# EAGLE schematic wagband_schematic (EAGLE 7.5.0)

## Sheet 1 of 2
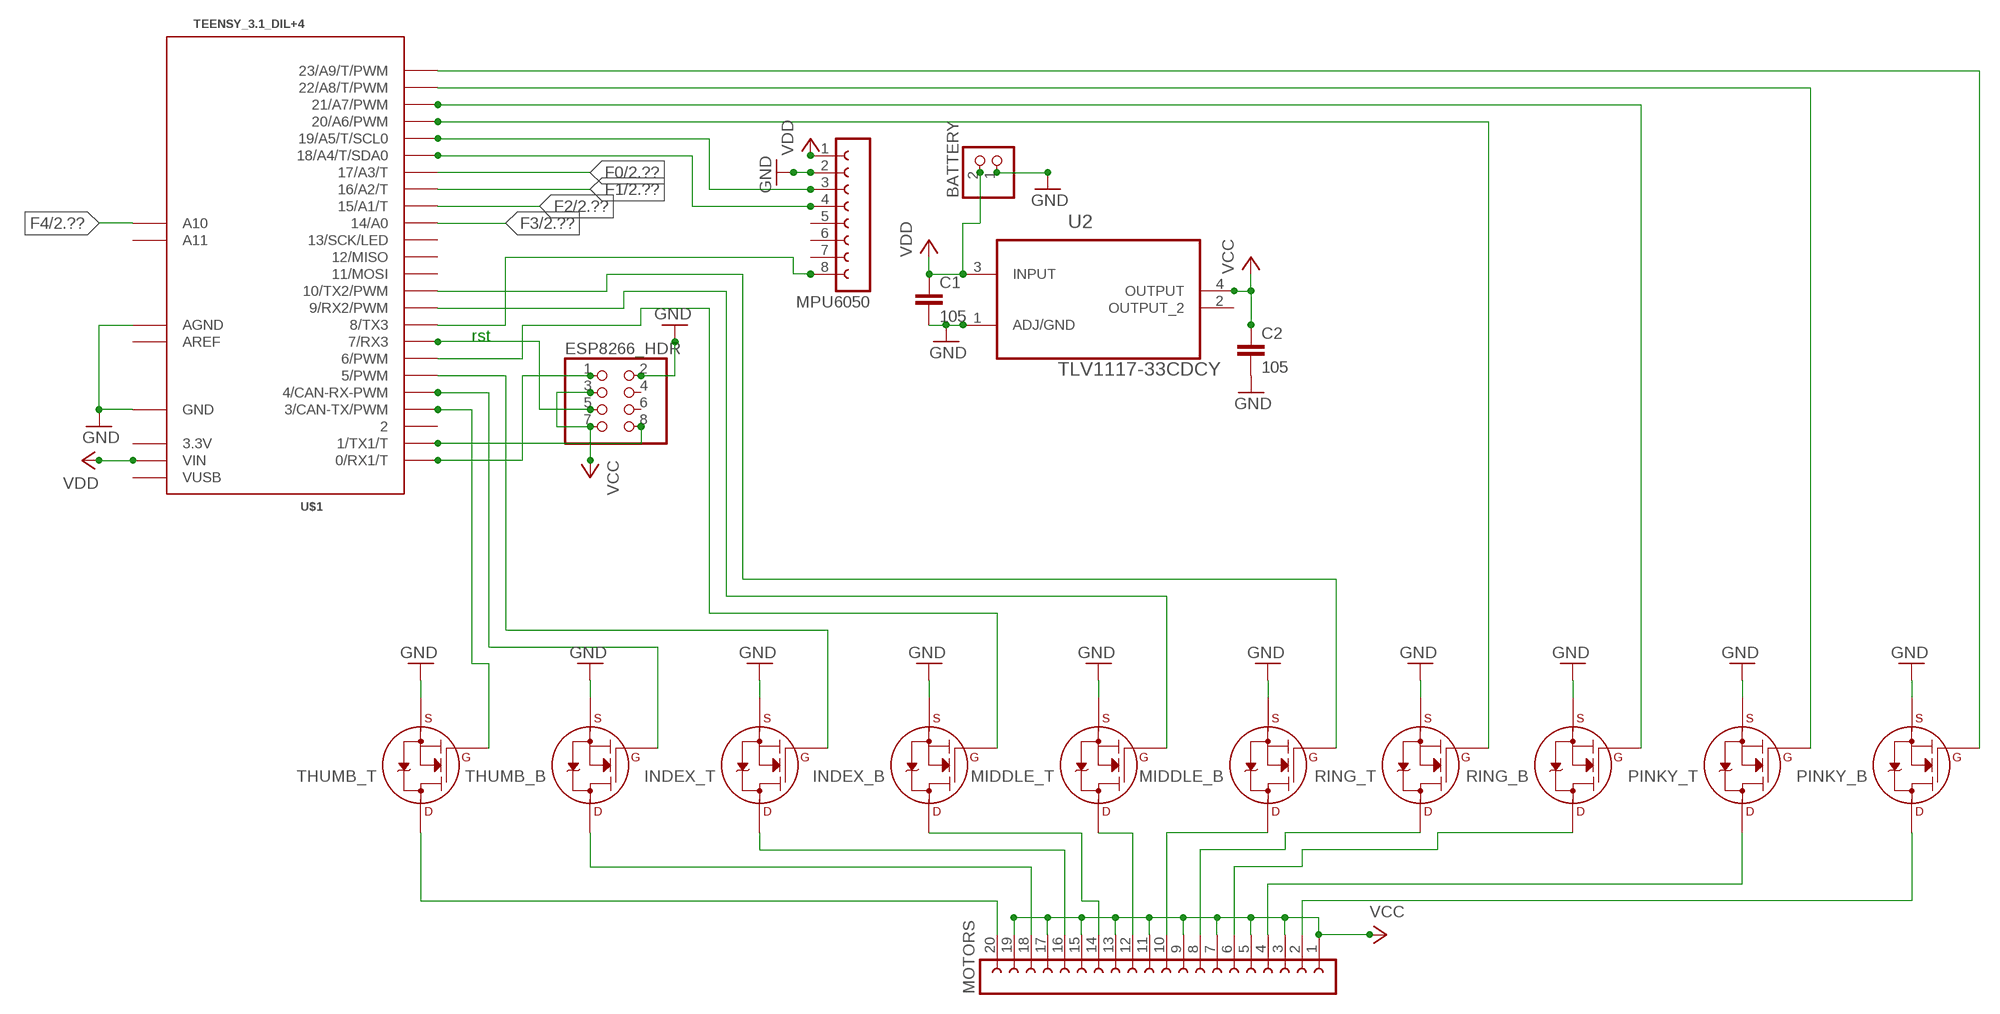
[diagram p0: schematic, sheet 1]

### Parts
BATTERY  JST_2PIN-THM-RA  [JST-PH-2-THM-RA]
C1  105  C-EU025-024X044  [C025-024X044]
C2  105  C-EU025-024X044  [C025-024X044]
ESP8266_HDR  PINHD-2X4  [2X04]
INDEX_B  2N7000_SOT23  [SOT-23]
INDEX_T  2N7000_SOT23  [SOT-23]
MIDDLE_B  2N7000_SOT23  [SOT-23]
MIDDLE_T  2N7000_SOT23  [SOT-23]
MOTORS  FE20W  [FE20W]
MPU6050  FE08-1  [FE08]
PINKY_B  2N7000_SOT23  [SOT-23]
PINKY_T  2N7000_SOT23  [SOT-23]
RING_B  2N7000_SOT23  [SOT-23]
RING_T  2N7000_SOT23  [SOT-23]
THUMB_B  2N7000_SOT23  [SOT-23]
THUMB_T  2N7000_SOT23  [SOT-23]
U2  TLV1117-33CDCY  [SOT230P700X180-4N]
U$1  TEENSY_3.1_DIL+4  [TEENSY3-DIL+4]

### Nets
F0: U$1.17/A3(17/A3/T) ; also sheet 2
F1: U$1.16/A2(16/A2/T) ; also sheet 2
F2: U$1.15/A1(15/A1/T) ; also sheet 2
F3: U$1.14/A0 ; also sheet 2
F4: U$1.A10 ; also sheet 2
GND: BATTERY.1 C1.2 C2.2 ESP8266_HDR.2 INDEX_B.2(S) INDEX_T.2(S) MIDDLE_B.2(S) MIDDLE_T.2(S) MPU6050.2 PINKY_B.2(S) PINKY_T.2(S) RING_B.2(S) RING_T.2(S) THUMB_B.2(S) THUMB_T.2(S) U2.1(ADJ/GND) U$1.AGND U$1.GND ; also sheet 2
N$1: RING_B.1(G) U$1.21/A7(21/A7/PWM)
N$2: INDEX_T.1(G) U$1.5(5/PWM)
N$3: RING_T.1(G) U$1.20/A6(20/A6/PWM)
N$4: MPU6050.4 U$1.18/A4(18/A4/T/SDA0)
N$5: THUMB_T.1(G) U$1.3(3/CAN-TX/PWM)
N$6: THUMB_B.1(G) U$1.4(4/CAN-RX-PWM)
N$7: ESP8266_HDR.1 U$1.0(0/RX1/T)
N$8: MPU6050.8 U$1.8(8/TX3)
N$9: MOTORS.20 THUMB_T.3(D)
N$10: MOTORS.18 THUMB_B.3(D)
N$11: INDEX_T.3(D) MOTORS.16
N$12: INDEX_B.3(D) MOTORS.14
N$13: MIDDLE_T.3(D) MOTORS.12
N$14: MIDDLE_B.3(D) MOTORS.10
N$15: MOTORS.8 RING_T.3(D)
N$16: INDEX_B.1(G) U$1.6(6/PWM)
N$17: MPU6050.3 U$1.19/A5(19/A5/T/SCL0)
N$18: MOTORS.6 RING_B.3(D)
N$19: ESP8266_HDR.8 U$1.1(1/TX1/T)
N$20: MOTORS.4 PINKY_T.3(D)
N$21: ESP8266_HDR.5 U$1.7(7/RX3)
N$22: MOTORS.2 PINKY_B.3(D)
N$23: MIDDLE_T.1(G) U$1.9(9/RX2/PWM)
N$25: MIDDLE_B.1(G) U$1.10(10/TX2/PWM)
N$26: PINKY_T.1(G) U$1.22/A8(22/A8/T/PWM)
N$27: PINKY_B.1(G) U$1.23/A9(23/A9/T/PWM)
VCC: BATTERY.2 C1.1 C2.1 ESP8266_HDR.3 ESP8266_HDR.7 MOTORS.1 MOTORS.3 MOTORS.5 MOTORS.7 MOTORS.9 MOTORS.11 MOTORS.13 MOTORS.15 MOTORS.17 MOTORS.19 MPU6050.1 U2.3(INPUT) U2.4(OUTPUT) U$1.VIN ; supply symbol labelled VDD
Unconnected: ESP8266_HDR.4 ESP8266_HDR.6 MPU6050.5 MPU6050.6 MPU6050.7 U2.2(OUTPUT_2) U$1.2 U$1.11(11/MOSI) U$1.12(12/MISO) U$1.13(13/SCK/LED) U$1.A11

### Notes on the sheet
- rst

## Sheet 2 of 2
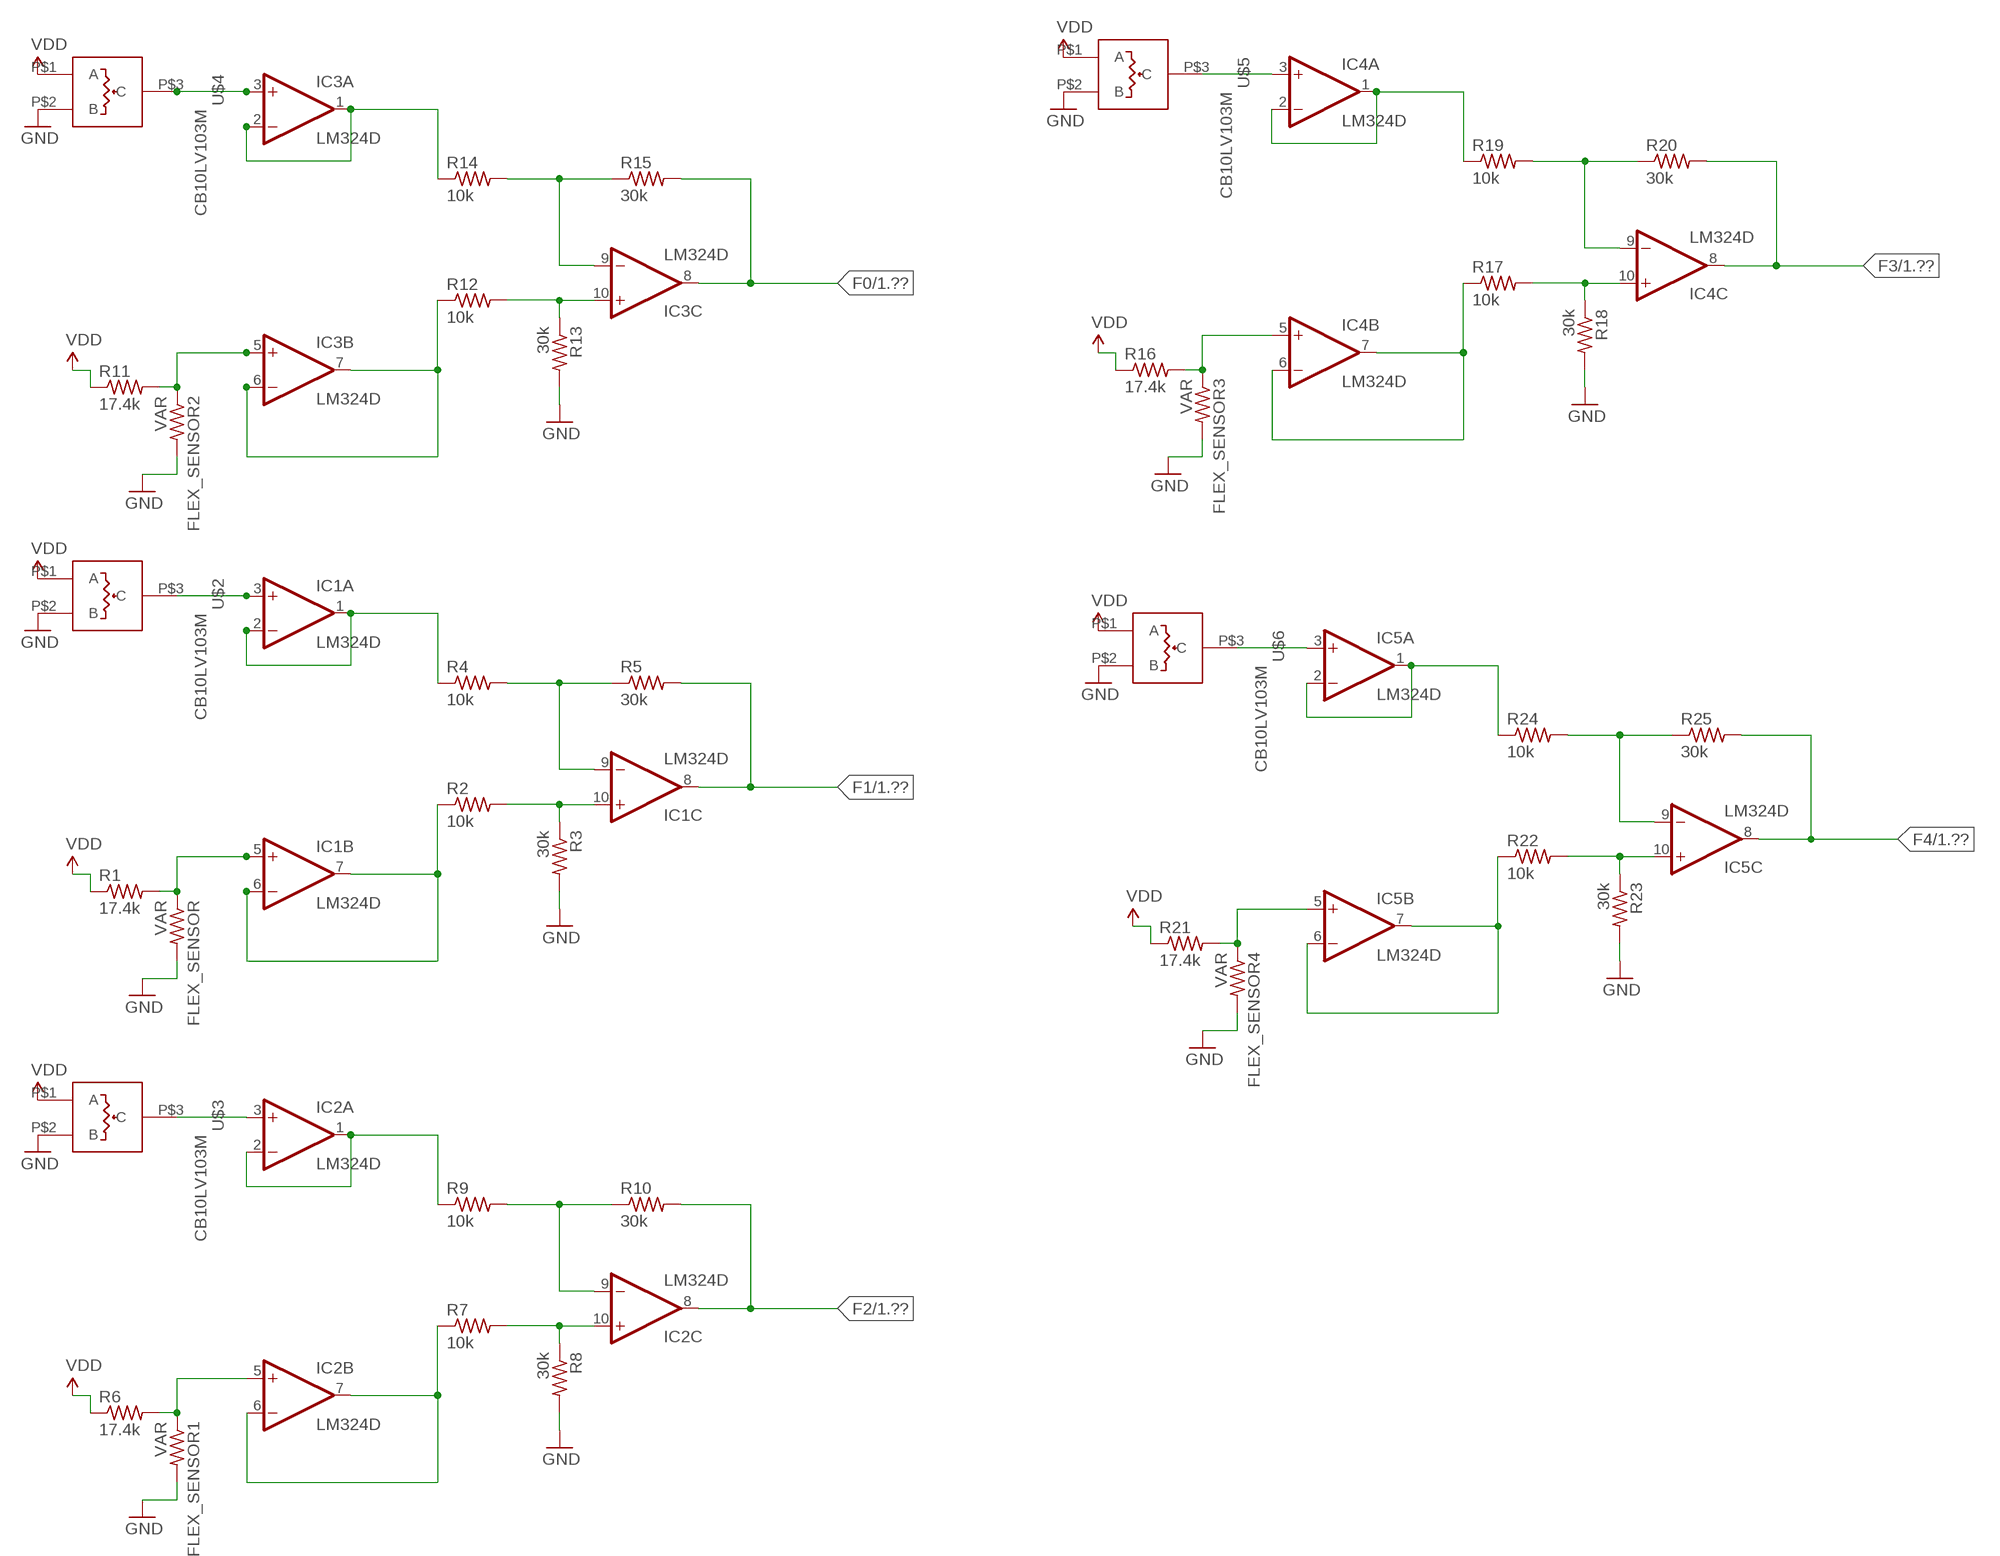
[diagram p1: schematic, sheet 2]

### Parts
FLEX_SENSOR  VAR  R-US_0207/2V  [0207/2V]
FLEX_SENSOR1  VAR  R-US_0207/2V  [0207/2V]
FLEX_SENSOR2  VAR  R-US_0207/2V  [0207/2V]
FLEX_SENSOR3  VAR  R-US_0207/2V  [0207/2V]
FLEX_SENSOR4  VAR  R-US_0207/2V  [0207/2V]
IC1  LM324D  [SO14]
IC2  LM324D  [SO14]
IC3  LM324D  [SO14]
IC4  LM324D  [SO14]
IC5  LM324D  [SO14]
R1  17.4k  R-US_R1206  [R1206]
R2  10k  R-US_R1206  [R1206]
R3  30k  R-US_R1206  [R1206]
R4  10k  R-US_R1206  [R1206]
R5  30k  R-US_R1206  [R1206]
R6  17.4k  R-US_R1206  [R1206]
R7  10k  R-US_R1206  [R1206]
R8  30k  R-US_R1206  [R1206]
R9  10k  R-US_R1206  [R1206]
R10  30k  R-US_R1206  [R1206]
R11  17.4k  R-US_R1206  [R1206]
R12  10k  R-US_R1206  [R1206]
R13  30k  R-US_R1206  [R1206]
R14  10k  R-US_R1206  [R1206]
R15  30k  R-US_R1206  [R1206]
R16  17.4k  R-US_R1206  [R1206]
R17  10k  R-US_R1206  [R1206]
R18  30k  R-US_R1206  [R1206]
R19  10k  R-US_R1206  [R1206]
R20  30k  R-US_R1206  [R1206]
R21  17.4k  R-US_R1206  [R1206]
R22  10k  R-US_R1206  [R1206]
R23  30k  R-US_R1206  [R1206]
R24  10k  R-US_R1206  [R1206]
R25  30k  R-US_R1206  [R1206]
U$2  CB10LV103M  [CB10]
U$3  CB10LV103M  [CB10]
U$4  CB10LV103M  [CB10]
U$5  CB10LV103M  [CB10]
U$6  CB10LV103M  [CB10]

### Nets
F0: IC3.8(C:OUT) R15.2 ; also sheet 1
F1: IC1.8(C:OUT) R5.2 ; also sheet 1
F2: IC2.8(C:OUT) R10.2 ; also sheet 1
F3: IC4.8(C:OUT) R20.2 ; also sheet 1
F4: IC5.8(C:OUT) R25.2 ; also sheet 1
GND: FLEX_SENSOR1.2 FLEX_SENSOR2.2 FLEX_SENSOR3.2 FLEX_SENSOR4.2 FLEX_SENSOR.2 R3.2 R8.2 R13.2 R18.2 R23.2 U$2.P$2(B) U$3.P$2(B) U$4.P$2(B) U$5.P$2(B) U$6.P$2(B) ; also sheet 1
N$24: FLEX_SENSOR.1 IC1.5(B:+IN) R1.2
N$28: IC1.3(A:+IN) U$2.P$3(C)
N$29: IC1.1(A:OUT) IC1.2(A:-IN) R4.1
N$30: IC1.6(B:-IN) IC1.7(B:OUT) R2.1
N$31: IC1.9(C:-IN) R4.2 R5.1
N$33: IC1.10(C:+IN) R2.2 R3.1
N$34: FLEX_SENSOR1.1 IC2.5(B:+IN) R6.2
N$35: IC2.1(A:OUT) IC2.2(A:-IN) R9.1
N$36: IC2.6(B:-IN) IC2.7(B:OUT) R7.1
N$37: IC2.9(C:-IN) R9.2 R10.1
N$38: IC2.10(C:+IN) R7.2 R8.1
N$39: IC2.3(A:+IN) U$3.P$3(C)
N$40: FLEX_SENSOR2.1 IC3.5(B:+IN) R11.2
N$41: IC3.1(A:OUT) IC3.2(A:-IN) R14.1
N$42: IC3.6(B:-IN) IC3.7(B:OUT) R12.1
N$43: IC3.9(C:-IN) R14.2 R15.1
N$44: IC3.10(C:+IN) R12.2 R13.1
N$45: IC3.3(A:+IN) U$4.P$3(C)
N$46: FLEX_SENSOR3.1 IC4.5(B:+IN) R16.2
N$47: IC4.1(A:OUT) IC4.2(A:-IN) R19.1
N$48: IC4.6(B:-IN) IC4.7(B:OUT) R17.1
N$49: IC4.9(C:-IN) R19.2 R20.1
N$50: IC4.10(C:+IN) R17.2 R18.1
N$51: IC4.3(A:+IN) U$5.P$3(C)
N$52: FLEX_SENSOR4.1 IC5.5(B:+IN) R21.2
N$53: IC5.1(A:OUT) IC5.2(A:-IN) R24.1
N$54: IC5.6(B:-IN) IC5.7(B:OUT) R22.1
N$55: IC5.9(C:-IN) R24.2 R25.1
N$56: IC5.10(C:+IN) R22.2 R23.1
N$57: IC5.3(A:+IN) U$6.P$3(C)
VDD: R1.1 R6.1 R11.1 R16.1 R21.1 U$2.P$1(A) U$3.P$1(A) U$4.P$1(A) U$5.P$1(A) U$6.P$1(A)
Unconnected: IC1.12(D:+IN) IC1.13(D:-IN) IC1.14(D:OUT) IC2.12(D:+IN) IC2.13(D:-IN) IC2.14(D:OUT) IC3.12(D:+IN) IC3.13(D:-IN) IC3.14(D:OUT) IC4.12(D:+IN) IC4.13(D:-IN) IC4.14(D:OUT) IC5.12(D:+IN) IC5.13(D:-IN) IC5.14(D:OUT)

## Power pins joined to a net without a drawn wire
3.3V: U$1.3.3V
AREF: U$1.AREF
V+: IC1.4(P:V+) IC2.4(P:V+) IC3.4(P:V+) IC4.4(P:V+) IC5.4(P:V+)
V-: IC1.11(P:V-) IC2.11(P:V-) IC3.11(P:V-) IC4.11(P:V-) IC5.11(P:V-)
VUSB: U$1.VUSB

## Library data of the parts
BATTERY = adafruit:JST_2PIN: JST 2-Pin Connectors of various flavors SMT-RA (S2B-PH-SM4) 4UConnector #17311 SMT (B2B-PH-SM4) THM-RA (S2B-PH) THM (B2B-PH)
C1 C2 = rcl:C-EU: CAPACITOR, European symbol
ESP8266_HDR = pinhead:PINHD-2X4: PIN HEADER
FLEX_SENSOR FLEX_SENSOR1-FLEX_SENSOR4 R1-R25 = resistor:R-US_: RESISTOR, American symbol
IC1-IC5 = linear:LM324: OP AMP
INDEX_B INDEX_T MIDDLE_B MIDDLE_T PINKY_B PINKY_T RING_B RING_T THUMB_B THUMB_T = transistors:2N700*: 2N7000, 2N7002, NDS7002A N-channel enhancement mode MOSFET
MOTORS = con-lsta:FE20W: FEMALE HEADER; OC_FARNELL: unknown; OC_NEWARK: unknown
MPU6050 = con-lsta:FE08-1: FEMALE HEADER; OC_FARNELL: unknown; OC_NEWARK: unknown
U2 = Texas Instruments_By_element14_Batch_1:TLV1117-33CDCY: V REG, LDO, 3.3V, 0.8A; MPN: TLV1117-33CDCY; OC_FARNELL: 1494942; OC_NEWARK: 67K8520; PACKAGE: SOT-223-3; SUPPLIER: TEXAS INSTRUMENTS
U$1 = Teensy_3_and_LC_Series_Boards_v1.1:TEENSY_3.1_DIL+4: Teensy 3.1 and 3.2 in a DIL package with the inner 4 pins
U$2-U$6 = mqp_custom_parts:CB10LV103M